# EAGLE design EL Escudo-v02 (EAGLE 5.01)
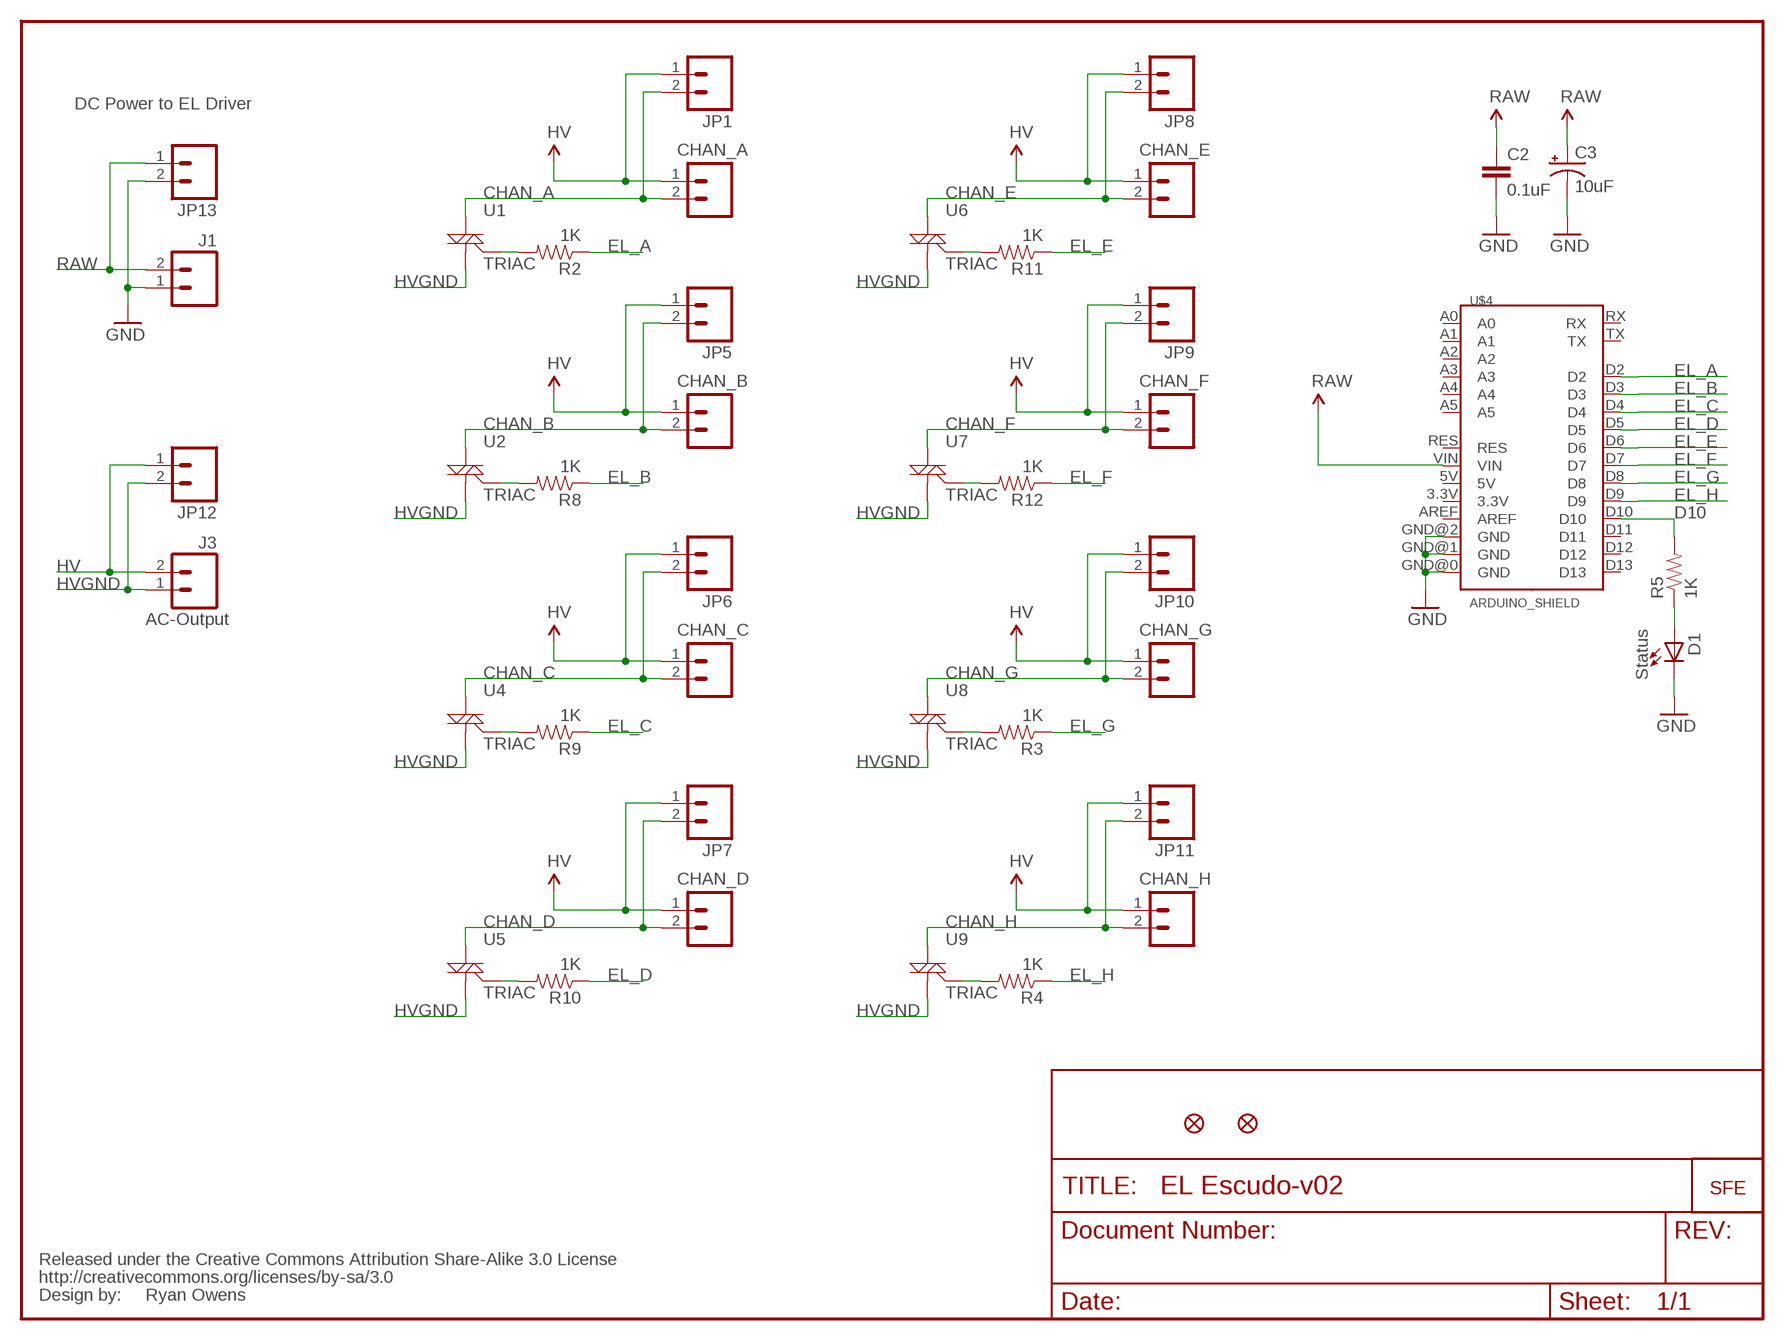
[diagram p0: schematic, sheet 1]

## Parts
C2  0.1uF  CAP0603-CAP  [0603-CAP]
C3  10uF  CAP_POL1206  [EIA3216]
CHAN_A  M02-JST-2MM-SMT  [S2B-PH]
CHAN_B  M02-JST-2MM-SMT  [S2B-PH]
CHAN_C  M02-JST-2MM-SMT  [S2B-PH]
CHAN_D  M02-JST-2MM-SMT  [S2B-PH]
CHAN_E  M02-JST-2MM-SMT  [S2B-PH]
CHAN_F  M02-JST-2MM-SMT  [S2B-PH]
CHAN_G  M02-JST-2MM-SMT  [S2B-PH]
CHAN_H  M02-JST-2MM-SMT  [S2B-PH]
D1  Status  LED0603  [LED-0603]
J1  M02-JST-2MM-SMT  [S2B-PH]
J3  AC-Output  M02-JST-2MM-SMT  [S2B-PH]
JP1  M02PTH  [1X02]
JP5  M02PTH  [1X02]
JP6  M02PTH  [1X02]
JP7  M02PTH  [1X02]
JP8  M02PTH  [1X02]
JP9  M02PTH  [1X02]
JP10  M02PTH  [1X02]
JP11  M02PTH  [1X02]
JP12  M02PTH  [1X02]
JP13  M02PTH  [1X02]
R2  1K  RESISTOR0603-RES  [0603-RES]
R3  1K  RESISTOR0603-RES  [0603-RES]
R4  1K  RESISTOR0603-RES  [0603-RES]
R5  1K  RESISTOR0603-RES  [0603-RES]
R8  1K  RESISTOR0603-RES  [0603-RES]
R9  1K  RESISTOR0603-RES  [0603-RES]
R10  1K  RESISTOR0603-RES  [0603-RES]
R11  1K  RESISTOR0603-RES  [0603-RES]
R12  1K  RESISTOR0603-RES  [0603-RES]
U1  TRIAC  TRIACSMD  [SOT223]
U2  TRIAC  TRIACSMD  [SOT223]
U4  TRIAC  TRIACSMD  [SOT223]
U5  TRIAC  TRIACSMD  [SOT223]
U6  TRIAC  TRIACSMD  [SOT223]
U7  TRIAC  TRIACSMD  [SOT223]
U8  TRIAC  TRIACSMD  [SOT223]
U9  TRIAC  TRIACSMD  [SOT223]
U$1  LOGO-SFENEW  [SFE-NEW-WEBLOGO]
U$2  FIDUCIAL1X2  [FIDUCIAL-1X2]
U$3  FIDUCIAL1X2  [FIDUCIAL-1X2]
U$4  ARDUINO_SHIELD  [DUEMILANOVE_SHIELD]
U$5  CREATIVE_COMMONS  [CREATIVE_COMMONS]

## Nets
CHAN_A: CHAN_A.2 JP1.2 U1.2(M2)
CHAN_B: CHAN_B.2 JP5.2 U2.2(M2)
CHAN_C: CHAN_C.2 JP6.2 U4.2(M2)
CHAN_D: CHAN_D.2 JP7.2 U5.2(M2)
CHAN_E: CHAN_E.2 JP8.2 U6.2(M2)
CHAN_F: CHAN_F.2 JP9.2 U7.2(M2)
CHAN_G: CHAN_G.2 JP10.2 U8.2(M2)
CHAN_H: CHAN_H.2 JP11.2 U9.2(M2)
D10: R5.2 U$4.D10
EL_A: R2.1 U$4.D2
EL_B: R8.1 U$4.D3
EL_C: R9.1 U$4.D4
EL_D: R10.1 U$4.D5
EL_E: R11.1 U$4.D6
EL_F: R12.1 U$4.D7
EL_G: R3.1 U$4.D8
EL_H: R4.1 U$4.D9
GND: C2.2 C3.C(-) D1.C J1.1 JP13.2 U$4.GND@0(GND) U$4.GND@1(GND) U$4.GND@2(GND)
HV: CHAN_A.1 CHAN_B.1 CHAN_C.1 CHAN_D.1 CHAN_E.1 CHAN_F.1 CHAN_G.1 CHAN_H.1 J3.2 JP1.1 JP5.1 JP6.1 JP7.1 JP8.1 JP9.1 JP10.1 JP11.1 JP12.1
HVGND: J3.1 JP12.2 U1.1(M1) U2.1(M1) U4.1(M1) U5.1(M1) U6.1(M1) U7.1(M1) U8.1(M1) U9.1(M1)
N$2: R3.2 U8.3(G)
N$3: R2.2 U1.3(G)
N$5: R4.2 U9.3(G)
N$9: R8.2 U2.3(G)
N$10: R9.2 U4.3(G)
N$12: R10.2 U5.3(G)
N$14: D1.A R5.1
N$15: R11.2 U6.3(G)
N$16: R12.2 U7.3(G)
RAW: C2.1 C3.A(+) J1.2 JP13.1 U$4.VIN
Unconnected: U$4.3.3V U$4.5V U$4.A0 U$4.A1 U$4.A2 U$4.A3 U$4.A4 U$4.A5 U$4.AREF U$4.D11 U$4.D12 U$4.D13 U$4.RES U$4.RX U$4.TX

## Notes on the sheet
- DC Power to EL Driver
- Ryan Owens

## Library data of the parts
C2 = SparkFun:CAP: Capacitor Standard 0603 ceramic capacitor, and 0.1" leaded capacitor.
C3 = SparkFun:CAP_POL: Capacitor Polarized These are standard SMD and PTH capacitors. Normally 10uF, 47uF, and 100uF in electrolytic and tantalum varieties. Always verify the external diameter of the through hole cap, it varies with capacity, voltage, and manufacturer. The EIA devices should be standard.
CHAN_A CHAN_B CHAN_C CHAN_D CHAN_E CHAN_F CHAN_G CHAN_H J1 J3 JP1 JP5-JP13 = SparkFun:M02: Header 2 Standard 2-pin 0.1" header. Use with straight break away headers (SKU : PRT-00116), right angle break away headers (PRT-00553), swiss pins (PRT-00743), machine pins (PRT-00117), and female headers (PRT-00115). Molex polarized connector foot print use with SKU : PRT-08233 with associated crimp pins and housings.
D1 = SparkFun:LED: LEDs Standard schematic elements and footprints for 5mm, 3mm, 1206, and 0603 sized LEDs. 5mm - Spark Fun Electronics SKU : COM-00529 (and others)
R2-R5 R8-R12 = SparkFun:RESISTOR: Resistor Basic schematic elements and footprints for 0603, 1206, and PTH 1/10th watt (small) resistors.
U1 U2 U4-U9 = SparkFun:TRIAC
U$1 = SparkFun:LOGO-SFE: Spark Fun Electronics PCB Logo This is the standard Spark Fun Electronics PCB logo.
U$2 U$3 = SparkFun:FIDUCIAL: Fiducial Alignment Points Various fiducial points for machine vision alignment.
U$4 = SparkFun:ARDUINO_SHIELD
U$5 = SparkFun:CREATIVE_COMMONS

## Net classes
0 Default: width 0.203 mm
1 VCC: width 0.305 mm
2 GND: width 0.813 mm
3 HV: width 0.381 mm

## Board
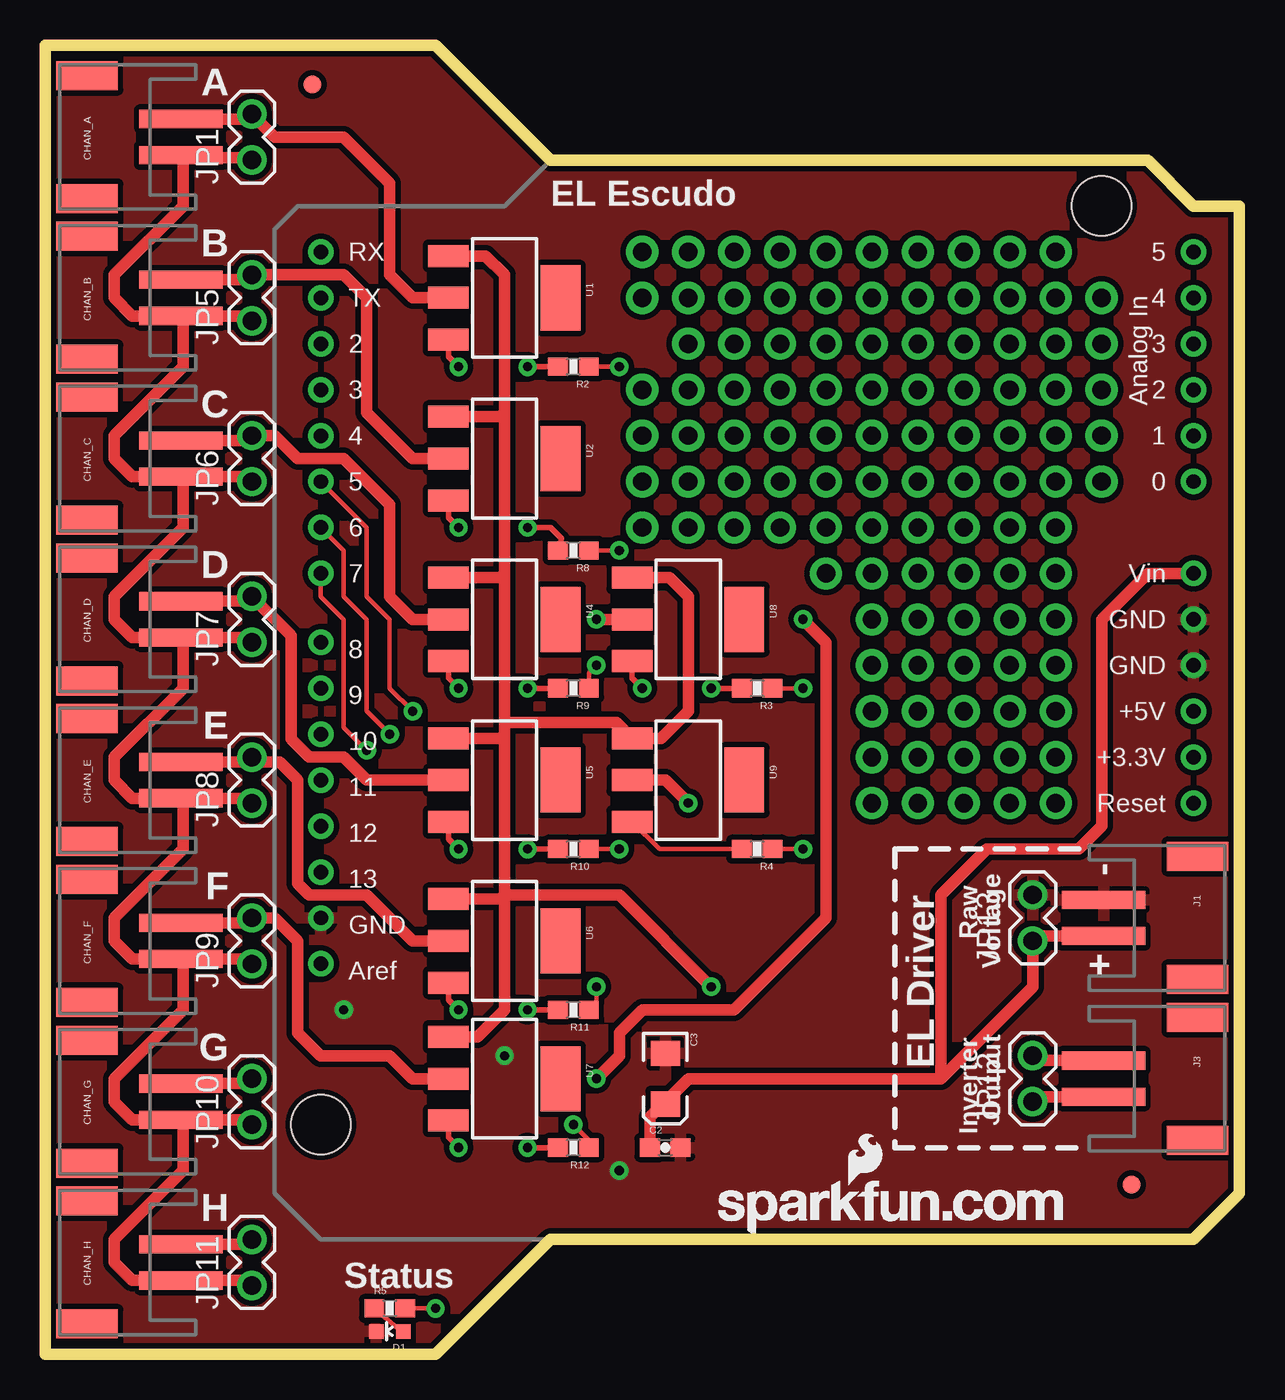
[diagram p1: board, top side]
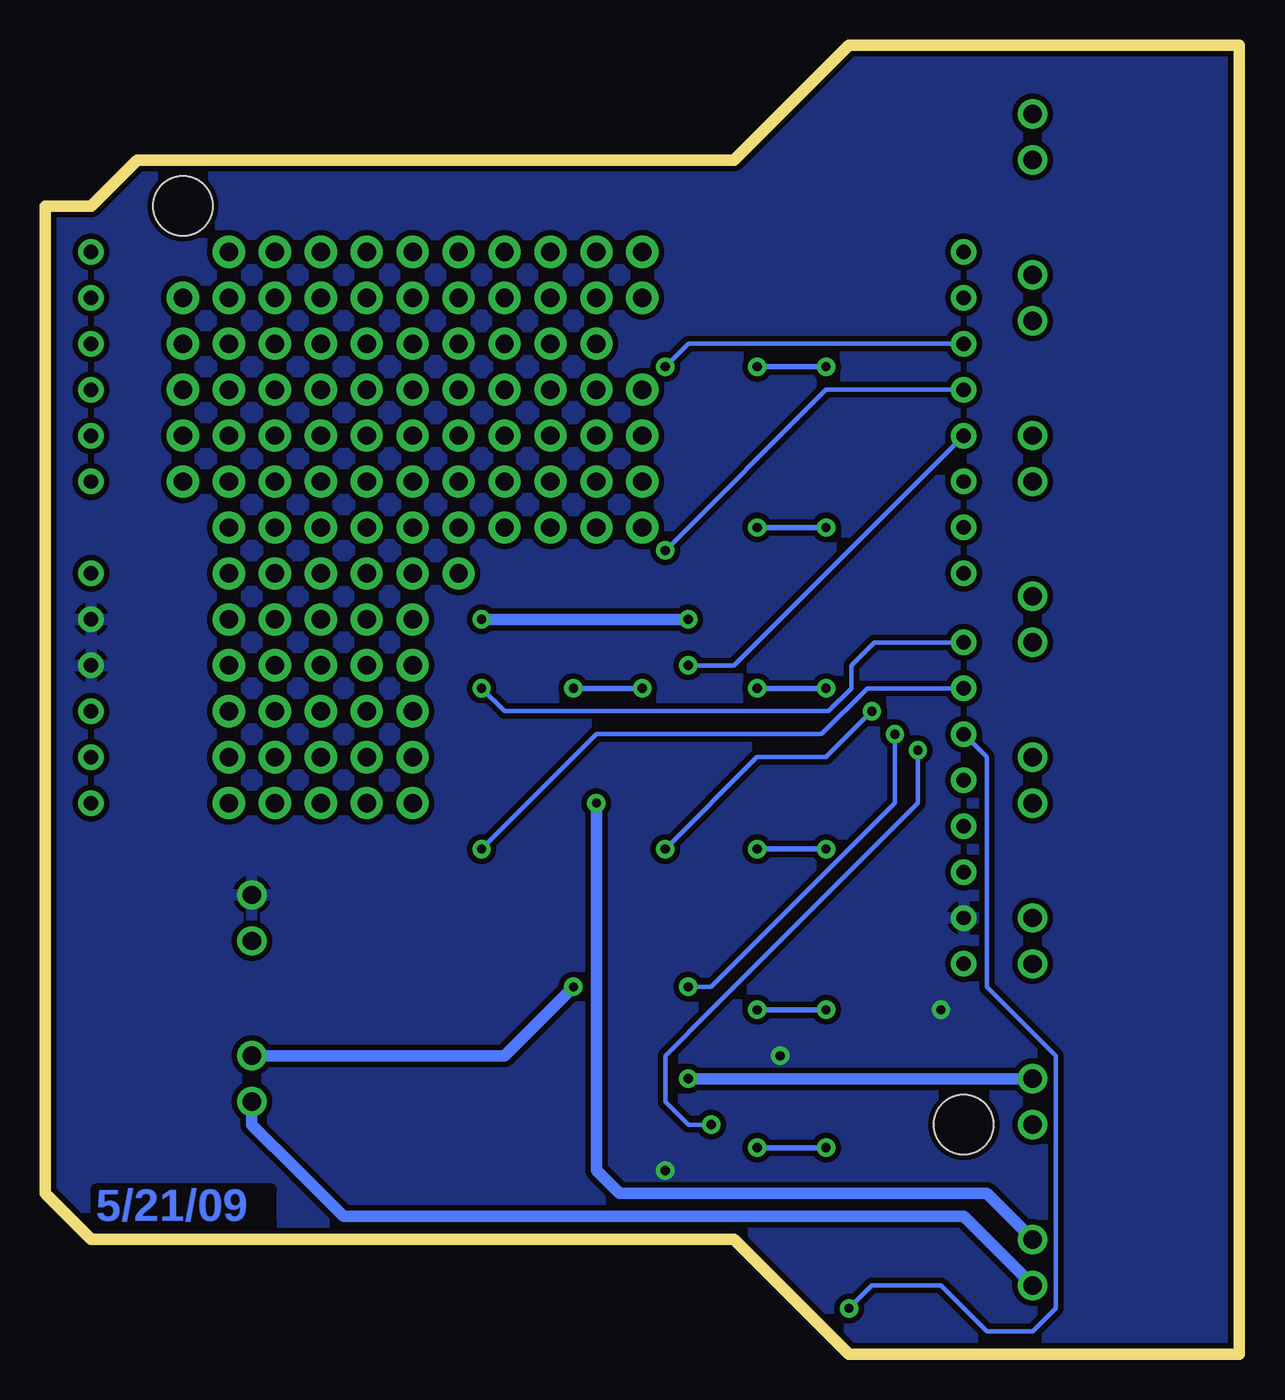
[diagram p2: board, bottom side, seen from below]

Size 66.04 x 72.39 mm. Coordinates in mm from the lower left corner, seen from the top.
Outline: 27.94,66.04 21.59,72.39 0,72.39 0,0 21.59,0 27.94,6.35 63.5,6.35 66.04,8.89 66.04,63.5 63.5,63.5 60.96,66.04 27.94,66.04
Copper layers (1*16): Top 0.035mm / dielectric 1.5mm / Bottom 0.035mm
Design rules "SparkFun": minimum track width 8mil, minimum drill 20mil, track to track 8mil, track to pad 8mil, pad to pad 8mil, via to via 8mil, smd to smd 8mil, copper to edge 10mil, drill to drill 8mil, minimum pad ring 12mil, minimum via ring 10mil, stop-mask expansion 4mil, vias tented up to drill 25mil, thermal gap 10mil

### Footprints (pad centres in the part's own frame; a part is rotated, then mirrored left to right if it is on the bottom)
0603-CAP = smd 1.1 x 1: 1 -0.85,0; 2 0.85,0
EIA3216 = smd 1.4 x 1.6: A 1.4,0; C -1.4,0
S2B-PH = smd 1 x 4.6: 1 -1,-3.7; 2 1,-3.7 | smd 1.6 x 3.4: NC1 -3.4,1.5; NC2 3.4,1.5
LED-0603 = smd 0.8 x 0.8: A 0,-0.75; C 0,0.75
1X02 = drill 1.016 round: 1 0,0; 2 2.54,0
0603-RES = smd 1.1 x 1: 1 -0.85,0; 2 0.85,0
SOT223 = smd 1.219 x 2.235: 1 -2.311,-3.099; 2 0,-3.099; 3 2.311,-3.099 | smd 3.6 x 2.2: 4 0,3.099
FIDUCIAL-1X2 = smd 1 x 1: 1 0,0
DUEMILANOVE_SHIELD = drill 0.8 round: 3.3V 26.67,2.54; 5V 29.21,2.54; A0 41.91,2.54; A1 44.45,2.54; A2 46.99,2.54; A3 49.53,2.54; A4 52.07,2.54; A5 54.61,2.54; AREF 15.24,50.8; D2 49.53,50.8; D3 46.99,50.8; D4 44.45,50.8; D5 41.91,50.8; D6 39.37,50.8; D7 36.83,50.8; D8 33.02,50.8; D9 30.48,50.8; D10 27.94,50.8; D11 25.4,50.8; D12 22.86,50.8; D13 20.32,50.8; GND@0 31.75,2.54; GND@1 34.29,2.54; GND@2 17.78,50.8; RES 24.13,2.54; RX 54.61,50.8; TX 52.07,50.8; VIN 36.83,2.54 | hole 3.302: 57.15,7.62; 6.35,50.8

### Placement (x,y rotation side)
C2  34.29,11.43 0 top
C3  34.29,15.24 270 top
CHAN_A  3.81,67.31 90 top
CHAN_B  3.81,58.42 90 top
CHAN_C  3.81,49.53 90 top
CHAN_D  3.81,40.64 90 top
CHAN_E  3.81,31.75 90 top
CHAN_F  3.81,22.86 90 top
CHAN_G  3.81,13.97 90 top
CHAN_H  3.81,5.08 90 top
D1  19.05,1.27 90 top
J1  62.23,24.13 270 top
J3  62.23,15.24 270 top
JP1  11.43,66.04 90 top
JP5  11.43,57.15 90 top
JP6  11.43,48.26 90 top
JP7  11.43,39.37 90 top
JP8  11.43,30.48 90 top
JP9  11.43,21.59 90 top
JP10  11.43,12.7 90 top
JP11  11.43,3.81 90 top
JP12  54.61,13.97 90 top
JP13  54.61,22.86 90 top
R2  29.21,54.61 180 top
R3  39.37,36.83 180 top
R4  39.37,27.94 180 top
R5  19.05,2.54 0 top
R8  29.21,44.45 180 top
R9  29.21,36.83 180 top
R10  29.21,27.94 180 top
R11  29.21,19.05 180 top
R12  29.21,11.43 180 top
U1  25.4,58.42 270 top
U2  25.4,49.53 270 top
U4  25.4,40.64 270 top
U5  25.4,31.75 270 top
U6  25.4,22.86 270 top
U7  25.4,15.24 270 top
U8  35.56,40.64 270 top
U9  35.56,31.75 270 top
U$1  37.21,6.48 0 top
U$2  14.78,70.23 0 top
U$3  60.07,9.37 0 top
U$4  66.04,6.35 90 top
U$5  21.59,-8.89 0 top  (outside the outline)

### Tracks (layer width: path | path; a pad name or v marks a point on that pad's centre or on a via)
CHAN_A
  Top 0.635: CHAN_A.2 11.16,68.31 JP1.2 12.7,67.31 16.51,67.31 19.05,64.77 19.05,59.69 20.32,58.42 U1.2
CHAN_B
  Top 0.635: CHAN_B.2 11.16,59.42 JP5.2 16.51,59.69 17.78,58.42 17.78,52.07 20.32,49.53 U2.2
CHAN_C
  Top 0.635: CHAN_C.2 11.16,50.53 JP6.2 12.7,50.8 13.97,49.53 16.51,49.53 17.78,48.26 19.05,46.99 19.05,41.91 20.32,40.64 U4.2
CHAN_D
  Top 0.635: CHAN_D.2 11.16,41.64 JP7.2 13.59,39.75 13.59,36.83 13.59,36.58 13.59,34.04 14.61,33.02 14.73,33.02 15.24,33.02 16.51,33.02 17.78,31.75 20.32,31.75 U5.2
CHAN_E
  Top 0.635: CHAN_E.2 11.16,32.75 | 11.16,32.75 JP8.2 | U6.2 20.32,22.86 19.05,24.13 18.8,24.38 17.78,25.4 17.02,25.4 14.61,25.4 13.97,26.04 13.97,31.75 12.97,32.75 11.16,32.75
CHAN_F
  Top 0.635: CHAN_F.2 11.16,23.86 JP9.2 12.7,24.13 13.97,22.86 13.97,17.78 15.24,16.51 19.05,16.51 20.32,15.24 U7.2
CHAN_G  (via drill 0.51)
  Top 0.635: CHAN_G.2 11.16,14.97 JP10.2 | v30.48,15.24 31.75,16.51 31.75,17.78 33.02,19.05 38.1,19.05 43.18,24.13 43.18,36.83 43.18,39.37 v41.91,40.64 | v30.48,40.64 U8.2
  Bottom 0.635: JP10.2 v30.48,15.24 | v41.91,40.64 v30.48,40.64
CHAN_H  (via drill 0.51)
  Top 0.635: CHAN_H.2 11.16,6.08 JP11.2 | U9.2 34.29,31.75 v35.56,30.48
  Bottom 0.635: v35.56,30.48 35.56,10.16 34.29,8.89 13.97,8.89 JP11.2
D10  (via drill 0.51)
  Top 0.254: v21.59,2.54 R5.2
  Bottom 0.254: U$4.D10 13.97,33.02 13.97,20.32 10.16,16.51 10.16,15.24 10.16,2.54 11.43,1.27 13.97,1.27 16.51,3.81 20.32,3.81 v21.59,2.54
EL_A  (via drill 0.51)
  Top 0.254: v31.75,54.61 R2.1
  Bottom 0.254: U$4.D2 30.48,55.88 v31.75,54.61
EL_B  (via drill 0.51)
  Top 0.254: v31.75,44.45 R8.1
  Bottom 0.254: U$4.D3 22.86,53.34 v31.75,44.45
EL_C  (via drill 0.51)
  Top 0.254: R9.1 30.06,37.68 v30.48,38.1
  Bottom 0.254: U$4.D4 21.59,44.45 27.94,38.1 v30.48,38.1
EL_D  (via drill 0.51)
  Top 0.254: U$4.D5 16.51,46.99 17.78,45.72 17.78,41.91 19.05,40.64 19.05,36.83 v20.32,35.56 | v31.75,27.94 R10.1
  Bottom 0.254: v20.32,35.56 22.86,33.02 25.4,33.02 26.67,33.02 v31.75,27.94
EL_E  (via drill 0.51)
  Top 0.254: U$4.D6 16.51,44.45 16.51,41.91 17.78,40.64 17.78,35.56 v19.05,34.29 | R11.1 30.48,19.47 v30.48,20.32
  Bottom 0.254: v19.05,34.29 19.05,30.48 22.86,26.67 29.21,20.32 v30.48,20.32
EL_F  (via drill 0.51)
  Top 0.254: U$4.D7 15.24,41.91 16.51,40.64 16.51,34.67 v17.78,33.4 | R12.1 30.48,11.43 v29.21,12.7
  Bottom 0.254: v17.78,33.4 17.78,30.48 27.94,20.32 29.21,19.05 31.75,16.51 31.75,13.97 30.48,12.7 v29.21,12.7
EL_G  (via drill 0.51)
  Top 0.254: v41.91,36.83 R3.1
  Bottom 0.254: U$4.D8 20.19,39.37 21.46,38.1 21.46,36.83 22.73,35.56 40.64,35.56 v41.91,36.83
EL_H  (via drill 0.51)
  Top 0.254: v41.91,27.94 R4.1
  Bottom 0.254: U$4.D9 20.57,36.83 23.11,34.29 35.56,34.29 v41.91,27.94
GND  (via drill 0.51)
  other vias: 31.75,10.16 16.51,19.05 25.4,16.51
  pour Top (isolate 0.305): 0,0 0,72.39 21.59,72.39 27.94,66.04 60.96,66.04 63.5,63.5 66.04,63.5 66.04,8.89 63.5,6.35 27.94,6.35 21.59,0
  pour Bottom (isolate 0.305): 0,0 21.59,0 27.94,6.35 63.5,6.35 66.04,8.89 66.04,63.5 63.5,63.5 60.96,66.04 27.94,66.04 21.59,72.39 0,72.39
HV
  Top 0.635: CHAN_E.1 7.51,30.72 | 7.51,39.73 7.49,39.75 | 7.51,39.73 CHAN_D.1 4.81,39.64 3.81,40.64 3.81,41.91 7.62,45.72 7.62,48.42 CHAN_C.1 | 7.62,39.62 7.62,36.83 3.81,33.02 3.81,31.75 4.81,30.75 CHAN_E.1 | 7.62,39.62 7.51,39.73 | 7.38,48.53 7.37,48.51 | 7.38,48.53 4.81,48.53 3.81,49.53 3.81,50.8 7.62,54.61 7.62,57.4 | 7.62,57.4 7.6,57.42 CHAN_B.1 4.81,57.42 3.81,58.42 3.81,59.69 7.62,63.5 7.62,66.17 | CHAN_A.1 7.49,66.29 7.62,66.17 | J3.2 54.88,14.24 JP12.1 | 7.62,66.17 11.3,66.17 JP1.1 | 7.62,57.4 11.18,57.4 JP5.1 | CHAN_C.1 11.16,48.53 JP6.1 | CHAN_C.1 7.38,48.53 | 7.62,39.62 11.18,39.62 JP7.1 | CHAN_E.1 11.16,30.75 JP8.1 | CHAN_E.1 7.62,30.64 7.62,27.94 3.81,24.13 3.81,22.86 4.81,21.86 CHAN_F.1 | CHAN_F.1 11.16,21.86 JP9.1 | CHAN_F.1 7.62,21.75 7.62,19.05 3.81,15.24 3.81,13.97 4.81,12.97 CHAN_G.1 | CHAN_G.1 11.16,12.97 JP10.1 | CHAN_G.1 7.62,12.86 7.62,10.16 3.81,6.35 3.81,5.08 4.81,4.08 CHAN_H.1 | CHAN_H.1 11.16,4.08 JP11.1 | CHAN_H.1 7.62,3.97
  Bottom 0.635: JP11.1 15.24,7.62 49.53,7.62 52.07,10.16 54.61,12.7 JP12.1
HVGND  (via drill 0.51)
  Top 0.305: JP12.2 54.61,16.24
  Top 0.635: 25.4,52.07 25.4,58.42 25.4,59.69 24.36,60.73 U1.1 | 25.4,43.18 25.4,52.07 | 25.4,34.29 25.4,34.92 | 25.4,34.92 25.4,43.18 | 25.4,25.4 25.4,34.29 | U2.1 25.17,51.84 25.4,52.07 | U4.1 25.17,42.95 25.4,43.18 | U5.1 25.17,34.06 25.4,34.29 | U6.1 25.17,25.17 25.4,25.4 | 54.61,16.24 J3.1 | U8.1 34.52,42.95 35.56,41.91 35.56,39.37 35.56,35.56 34.06,34.06 U9.1 31.6,34.92 25.53,34.92 25.4,34.92 | U7.1 23.9,17.55 25.4,19.05 25.4,25.4 | 25.4,25.4 31.75,25.4 v36.83,20.32
  Bottom 0.635: JP12.2 40.64,16.51 v36.83,20.32
N$1  (via drill 1.02 pad 1.78)
  other vias: 35.56,60.96
N$2  (via drill 0.51)
  Top 0.305: v36.83,36.83 R3.2 | U8.3 32.46,37.39 v33.02,36.83
  Bottom 0.305: v33.02,36.83 v36.83,36.83
N$3  (via drill 0.51)
  Top 0.305: v26.67,54.61 R2.2 | U1.3 22.3,55.17 v22.86,54.61
  Bottom 0.305: v22.86,54.61 v26.67,54.61
N$4  (via drill 1.02 pad 1.78)
  other vias: 38.1,60.96
N$5
  Top 0.254: R4.2 33.96,27.94 U9.3
N$6  (via drill 1.02 pad 1.78)
  other vias: 40.64,60.96
N$7  (via drill 1.02 pad 1.78)
  other vias: 43.18,60.96
N$8  (via drill 1.02 pad 1.78)
  other vias: 45.72,60.96
N$9  (via drill 0.51)
  Top 0.305: U2.3 22.3,46.28 v22.86,45.72 | R8.2 28.56,45.1 27.94,45.72 v26.67,45.72
  Bottom 0.305: v22.86,45.72 v26.67,45.72
N$10  (via drill 0.51)
  Top 0.305: v26.67,36.83 R9.2 | U4.3 22.3,37.39 v22.86,36.83
  Bottom 0.305: v22.86,36.83 v26.67,36.83
N$11  (via drill 1.02 pad 1.78)
  other vias: 48.26,60.96
N$12  (via drill 0.51)
  Top 0.305: v26.67,27.94 R10.2 | U5.3 22.3,28.5 v22.86,27.94
  Bottom 0.305: v22.86,27.94 v26.67,27.94
N$13  (via drill 1.02 pad 1.78)
  other vias: 50.8,60.96
N$14
  Top 0.254: 19.67,1.27 R5.1
  Top 0.305: D1.A 19.67,1.27
N$15  (via drill 0.51)
  Top 0.305: v26.67,19.05 R11.2 | U6.3 22.3,19.61 v22.86,19.05
  Bottom 0.305: v22.86,19.05 v26.67,19.05
N$16  (via drill 0.51)
  Top 0.305: v26.67,11.43 R12.2 | U7.3 22.3,11.99 v22.86,11.43
  Bottom 0.305: v22.86,11.43 v26.67,11.43
N$17  (via drill 1.02 pad 1.78)
  other vias: 53.34,60.96
N$18  (via drill 1.02 pad 1.78)
  other vias: 55.88,60.96
N$19  (via drill 1.02 pad 1.78)
  other vias: 35.56,58.42
N$20  (via drill 1.02 pad 1.78)
  other vias: 38.1,58.42
N$21  (via drill 1.02 pad 1.78)
  other vias: 40.64,58.42
N$22  (via drill 1.02 pad 1.78)
  other vias: 43.18,58.42
N$23  (via drill 1.02 pad 1.78)
  other vias: 45.72,58.42
N$24  (via drill 1.02 pad 1.78)
  other vias: 48.26,58.42
N$25  (via drill 1.02 pad 1.78)
  other vias: 50.8,58.42
N$26  (via drill 1.02 pad 1.78)
  other vias: 53.34,58.42
N$27  (via drill 1.02 pad 1.78)
  other vias: 55.88,58.42
N$28  (via drill 1.02 pad 1.78)
  other vias: 35.56,55.88
N$29  (via drill 1.02 pad 1.78)
  other vias: 38.1,55.88
N$30  (via drill 1.02 pad 1.78)
  other vias: 40.64,55.88
N$31  (via drill 1.02 pad 1.78)
  other vias: 43.18,55.88
N$32  (via drill 1.02 pad 1.78)
  other vias: 45.72,55.88
N$33  (via drill 1.02 pad 1.78)
  other vias: 48.26,55.88
N$34  (via drill 1.02 pad 1.78)
  other vias: 50.8,55.88
N$35  (via drill 1.02 pad 1.78)
  other vias: 53.34,55.88
N$36  (via drill 1.02 pad 1.78)
  other vias: 55.88,55.88
N$37  (via drill 1.02 pad 1.78)
  other vias: 35.56,53.34
N$38  (via drill 1.02 pad 1.78)
  other vias: 38.1,53.34
N$39  (via drill 1.02 pad 1.78)
  other vias: 40.64,53.34
N$40  (via drill 1.02 pad 1.78)
  other vias: 43.18,53.34
N$41  (via drill 1.02 pad 1.78)
  other vias: 45.72,53.34
N$42  (via drill 1.02 pad 1.78)
  other vias: 48.26,53.34
N$43  (via drill 1.02 pad 1.78)
  other vias: 50.8,53.34
N$44  (via drill 1.02 pad 1.78)
  other vias: 53.34,53.34
N$45  (via drill 1.02 pad 1.78)
  other vias: 55.88,53.34
N$46  (via drill 1.02 pad 1.78)
  other vias: 35.56,50.8
N$47  (via drill 1.02 pad 1.78)
  other vias: 38.1,50.8
N$48  (via drill 1.02 pad 1.78)
  other vias: 40.64,50.8
N$49  (via drill 1.02 pad 1.78)
  other vias: 43.18,50.8
N$50  (via drill 1.02 pad 1.78)
  other vias: 45.72,50.8
N$51  (via drill 1.02 pad 1.78)
  other vias: 48.26,50.8
N$52  (via drill 1.02 pad 1.78)
  other vias: 50.8,50.8
N$53  (via drill 1.02 pad 1.78)
  other vias: 53.34,50.8
N$54  (via drill 1.02 pad 1.78)
  other vias: 55.88,50.8
N$55  (via drill 1.02 pad 1.78)
  other vias: 35.56,48.26
N$56  (via drill 1.02 pad 1.78)
  other vias: 38.1,48.26
N$57  (via drill 1.02 pad 1.78)
  other vias: 40.64,48.26
N$58  (via drill 1.02 pad 1.78)
  other vias: 43.18,48.26
N$59  (via drill 1.02 pad 1.78)
  other vias: 45.72,48.26
N$60  (via drill 1.02 pad 1.78)
  other vias: 48.26,48.26
N$61  (via drill 1.02 pad 1.78)
  other vias: 50.8,48.26
N$62  (via drill 1.02 pad 1.78)
  other vias: 53.34,48.26
N$63  (via drill 1.02 pad 1.78)
  other vias: 55.88,48.26
N$64  (via drill 1.02 pad 1.78)
  other vias: 35.56,45.72
N$65  (via drill 1.02 pad 1.78)
  other vias: 38.1,45.72
N$66  (via drill 1.02 pad 1.78)
  other vias: 40.64,45.72
N$67  (via drill 1.02 pad 1.78)
  other vias: 43.18,45.72
N$68  (via drill 1.02 pad 1.78)
  other vias: 45.72,45.72
N$69  (via drill 1.02 pad 1.78)
  other vias: 48.26,45.72
N$70  (via drill 1.02 pad 1.78)
  other vias: 50.8,45.72
N$71  (via drill 1.02 pad 1.78)
  other vias: 53.34,45.72
N$72  (via drill 1.02 pad 1.78)
  other vias: 55.88,45.72
N$73  (via drill 1.02 pad 1.78)
  other vias: 55.88,30.48
N$74  (via drill 1.02 pad 1.78)
  other vias: 55.88,33.02
N$75  (via drill 1.02 pad 1.78)
  other vias: 55.88,35.56
N$76  (via drill 1.02 pad 1.78)
  other vias: 55.88,38.1
N$77  (via drill 1.02 pad 1.78)
  other vias: 55.88,40.64
N$78  (via drill 1.02 pad 1.78)
  other vias: 55.88,43.18
N$79  (via drill 1.02 pad 1.78)
  other vias: 53.34,30.48
N$80  (via drill 1.02 pad 1.78)
  other vias: 53.34,33.02
N$81  (via drill 1.02 pad 1.78)
  other vias: 53.34,35.56
N$82  (via drill 1.02 pad 1.78)
  other vias: 53.34,38.1
N$83  (via drill 1.02 pad 1.78)
  other vias: 53.34,40.64
N$84  (via drill 1.02 pad 1.78)
  other vias: 53.34,43.18
N$85  (via drill 1.02 pad 1.78)
  other vias: 50.8,30.48
N$86  (via drill 1.02 pad 1.78)
  other vias: 50.8,33.02
N$87  (via drill 1.02 pad 1.78)
  other vias: 50.8,35.56
N$88  (via drill 1.02 pad 1.78)
  other vias: 50.8,38.1
N$89  (via drill 1.02 pad 1.78)
  other vias: 50.8,40.64
N$90  (via drill 1.02 pad 1.78)
  other vias: 50.8,43.18
N$91  (via drill 1.02 pad 1.78)
  other vias: 48.26,30.48
N$92  (via drill 1.02 pad 1.78)
  other vias: 48.26,33.02
N$93  (via drill 1.02 pad 1.78)
  other vias: 48.26,35.56
N$94  (via drill 1.02 pad 1.78)
  other vias: 48.26,38.1
N$95  (via drill 1.02 pad 1.78)
  other vias: 48.26,40.64
N$96  (via drill 1.02 pad 1.78)
  other vias: 48.26,43.18
N$97  (via drill 1.02 pad 1.78)
  other vias: 45.72,30.48
N$98  (via drill 1.02 pad 1.78)
  other vias: 45.72,33.02
N$99  (via drill 1.02 pad 1.78)
  other vias: 45.72,35.56
N$100  (via drill 1.02 pad 1.78)
  other vias: 45.72,38.1
N$101  (via drill 1.02 pad 1.78)
  other vias: 45.72,40.64
N$102  (via drill 1.02 pad 1.78)
  other vias: 45.72,43.18
N$103  (via drill 1.02 pad 1.78)
  other vias: 43.18,43.18
N$104  (via drill 1.02 pad 1.78)
  other vias: 33.02,60.96
N$105  (via drill 1.02 pad 1.78)
  other vias: 33.02,58.42
N$106  (via drill 1.02 pad 1.78)
  other vias: 33.02,50.8
N$107  (via drill 1.02 pad 1.78)
  other vias: 33.02,48.26
N$108  (via drill 1.02 pad 1.78)
  other vias: 33.02,45.72
N$109  (via drill 1.02 pad 1.78)
  other vias: 33.02,53.34
N$110  (via drill 1.02 pad 1.78)
  other vias: 58.42,48.26
N$111  (via drill 1.02 pad 1.78)
  other vias: 58.42,50.8
N$112  (via drill 1.02 pad 1.78)
  other vias: 58.42,53.34
N$113  (via drill 1.02 pad 1.78)
  other vias: 58.42,55.88
N$114  (via drill 1.02 pad 1.78)
  other vias: 58.42,58.42
RAW
  Top 0.635: J1.2 54.88,23.13 JP13.1 54.61,20.32 49.53,15.24 | 34.29,13.97 C3.A 34.29,13.97 | 34.29,13.97 35.56,15.24 49.53,15.24 | C2.1 33.44,13.12 34.29,13.97 | U$4.VIN 60.96,43.18 58.42,40.64 58.42,29.21 57.15,27.94 52.07,27.94 49.53,25.4 49.53,15.24

### Text on the board
Bottom: 5/21/09
tPlace: A | EL Escudo | B | C | D | E | F | - | EL Driver | Raw | + | Voltage | G | Output | Inverter | H | Status
tValues: Ryan Owens